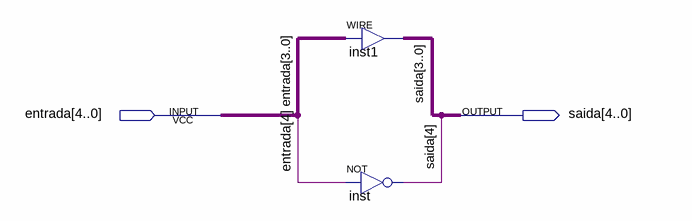
[diagram p0: schematic sheet]
// Quartus schematic NegadorDeSinalPara5Bits.bdf as structural Verilog: 2 symbols, 2 pins
module NegadorDeSinalPara5Bits (
  input  [4:0] entrada,
  output [4:0] saida
);

  assign saida[3:0] = entrada[3:0];  // WIRE inst1
  not inst (saida[4], entrada[4]);
endmodule
